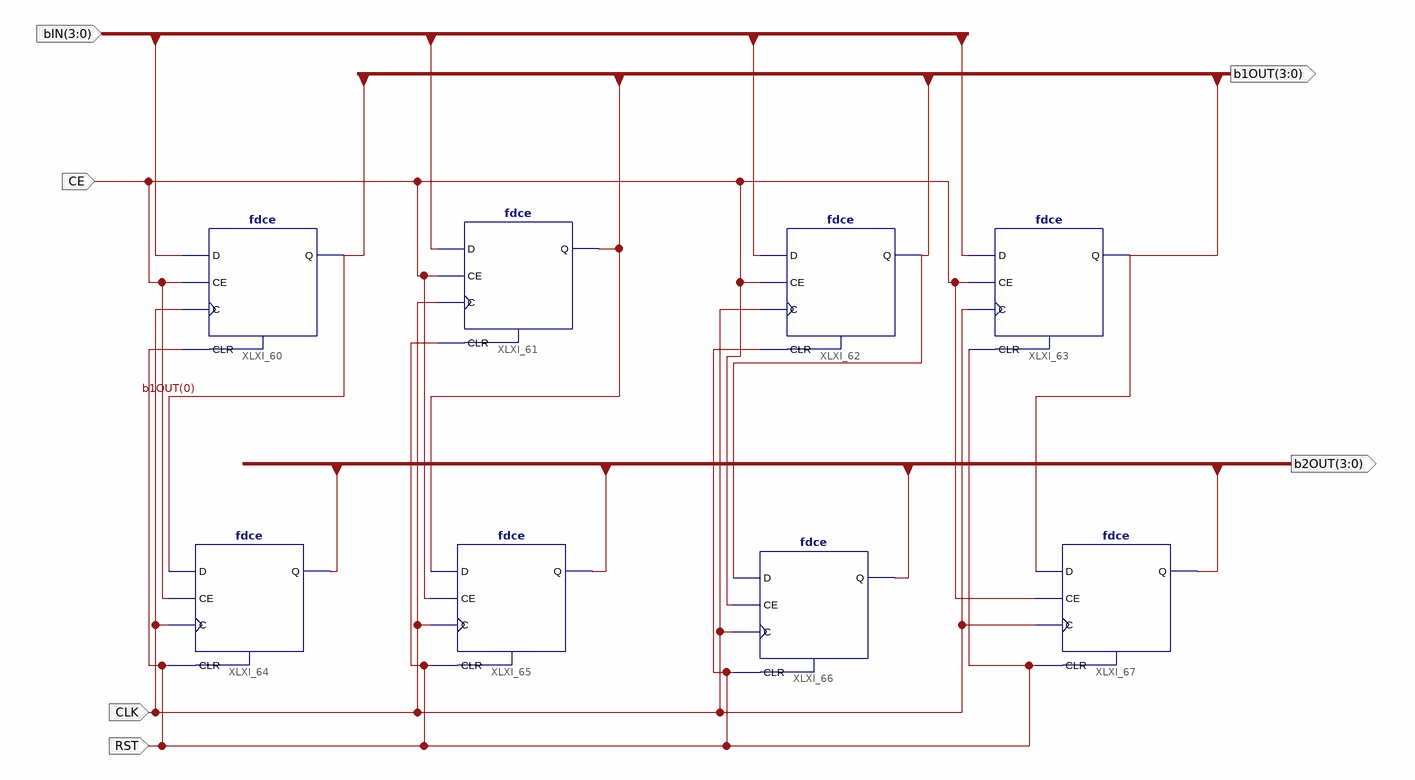
[diagram p0: schematic sheet 1]
// Xilinx ISE schematic hex_shifter_cust.sch (spartan3e) as structural Verilog: 8 symbols, 6 ports
module hex_shifter_cust (
  input  [3:0] bIN,
  input  CE,
  input  CLK,
  input  RST,
  output [3:0] b1OUT,
  output [3:0] b2OUT
);

  fdce XLXI_60 (.C(CLK), .CE(CE), .CLR(RST), .D(bIN[0]), .Q(b1OUT[0]));
  fdce XLXI_64 (.C(CLK), .CE(CE), .CLR(RST), .D(b1OUT[0]), .Q(b2OUT[0]));
  fdce XLXI_65 (.C(CLK), .CE(CE), .CLR(RST), .D(b1OUT[1]), .Q(b2OUT[1]));
  fdce XLXI_66 (.C(CLK), .CE(CE), .CLR(RST), .D(b1OUT[2]), .Q(b2OUT[2]));
  fdce XLXI_67 (.C(CLK), .CE(CE), .CLR(RST), .D(b1OUT[3]), .Q(b2OUT[3]));
  fdce XLXI_61 (.C(CLK), .CE(CE), .CLR(RST), .D(bIN[1]), .Q(b1OUT[1]));
  fdce XLXI_62 (.C(CLK), .CE(CE), .CLR(RST), .D(bIN[2]), .Q(b1OUT[2]));
  fdce XLXI_63 (.C(CLK), .CE(CE), .CLR(RST), .D(bIN[3]), .Q(b1OUT[3]));
endmodule
